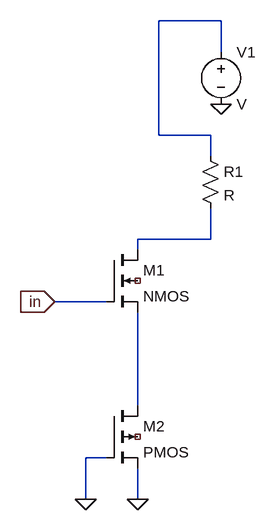
[diagram p0: schematic Draft3.asc]
Draft3.asc, the LTspice schematic file:
Version 4
SHEET 1 880 756
WIRE 272 0 176 0
WIRE 272 48 272 0
WIRE 176 176 176 0
WIRE 256 176 176 176
WIRE 256 208 256 176
WIRE 256 336 256 288
WIRE 256 336 144 336
WIRE 144 352 144 336
WIRE 96 432 16 432
WIRE 144 592 144 448
WIRE 96 672 64 672
WIRE 64 736 64 672
WIRE 144 736 144 688
FLAG 272 128 0
FLAG 144 736 0
FLAG 64 736 0
FLAG 16 432 in
IOPIN 16 432 In
SYMBOL voltage 272 32 R0
SYMATTR InstName V1
SYMBOL res 240 192 R0
SYMATTR InstName R1
SYMBOL nmos4 96 352 R0
SYMATTR InstName M1
SYMBOL pmos4 96 592 R0
SYMATTR InstName M2

The netlist it stands for:
* Draft3.asc
V1 N001 0 V
R1 N001 N002 R
M1 N002 in N003 NC_01 NMOS
M2 N003 0 0 NC_02 PMOS
.model NMOS NMOS
.model PMOS PMOS
.lib standard.mos
.backanno
.end